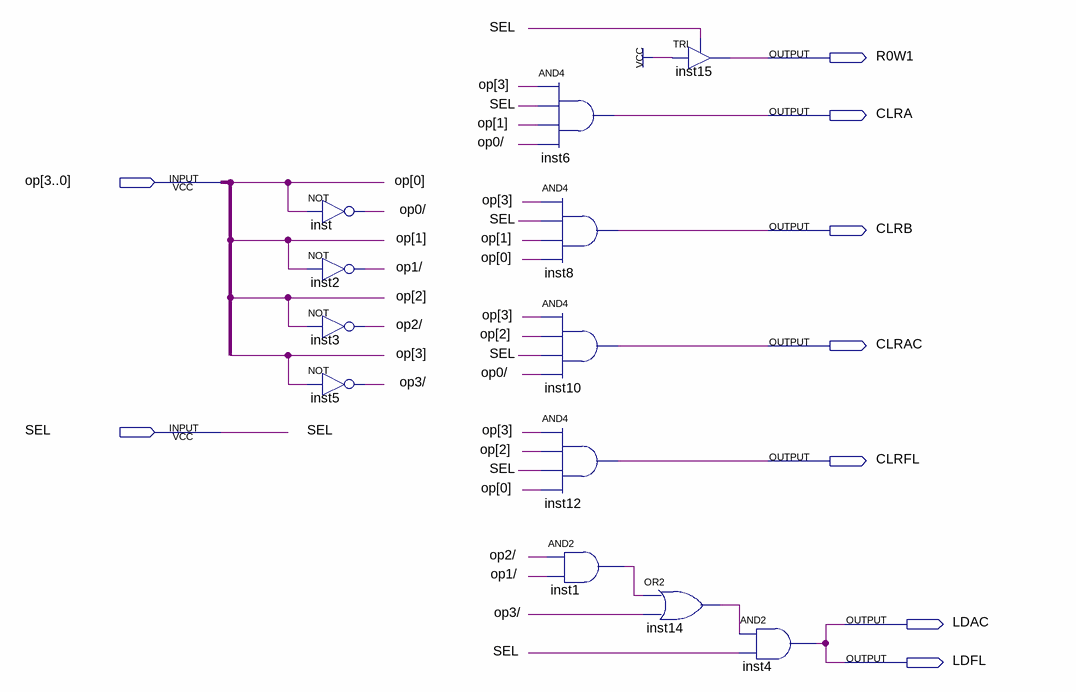
[diagram p0: schematic sheet]
// Quartus schematic decod_inst_art.bdf as structural Verilog: 12 symbols, 9 pins
module decod_inst_art (
  input  [3:0] op,
  input  SEL,
  output R0W1,
  output CLRA,
  output CLRB,
  output CLRAC,
  output CLRFL,
  output LDAC,
  output LDFL
);

  wire inst1_out, inst14_out, \op0/ , \op1/ , \op2/ , \op3/ ;

  not inst (\op0/ , op[0]);
  not inst2 (\op1/ , op[1]);
  not inst3 (\op2/ , op[2]);
  not inst5 (\op3/ , op[3]);
  and inst6 (CLRA, op[3], SEL, op[1], \op0/ );
  and inst8 (CLRB, op[3], SEL, op[1], op[0]);
  and inst10 (CLRAC, op[3], op[2], SEL, \op0/ );
  and inst12 (CLRFL, op[3], op[2], SEL, op[0]);
  and inst1 (inst1_out, \op2/ , \op1/ );
  TRI inst15 (.IN(1'b1), .OE(SEL), .OUT(R0W1));
  or inst14 (inst14_out, inst1_out, \op3/ );
  and inst4 (LDAC, inst14_out, SEL);

  assign LDFL = LDAC;
endmodule
